# EAGLE design Dual Power (EAGLE 9.6.2)
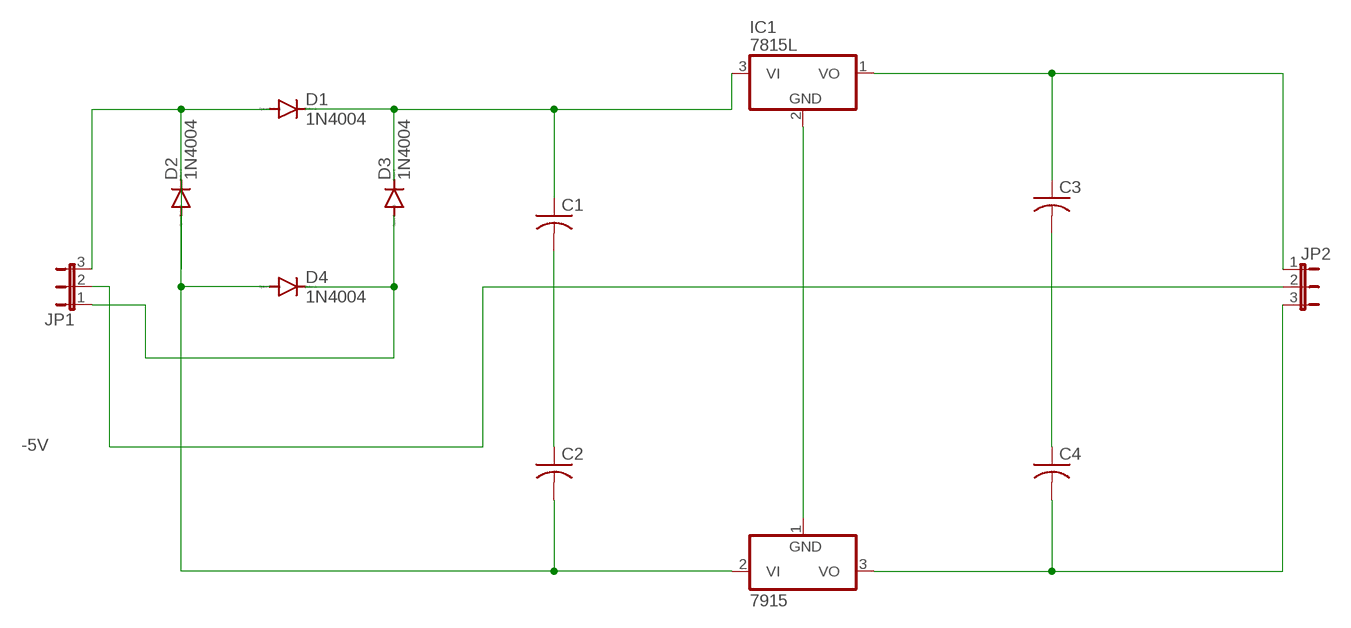
[diagram p0: schematic, sheet 1]

## Parts
7915  7915L  [TO92]
C1  C-US025-025X050  [C025-025X050]
C2  C-US025-025X050  [C025-025X050]
C3  C-US025-025X050  [C025-025X050]
C4  C-US025-025X050  [C025-025X050]
D1  1N4004  [DO41-10]
D2  1N4004  [DO41-10]
D3  1N4004  [DO41-10]
D4  1N4004  [DO41-10]
IC1  7815L  [TO92]
JP1  JP2E  [JP2]
JP2  -5V  JP2E  [JP2]

## Nets
N$1: D3.A D4.C JP1.1
N$2: D1.A D2.C JP1.3
N$3: C1.1 D1.C D3.C IC1.3(VI)
N$4: JP1.2 JP2.2
N$5: 7915.1(GND) IC1.2(GND)
N$6: C1.2 C2.1
N$7: C3.1 IC1.1(VO) JP2.1
N$8: 7915.3(VO) C4.2 JP2.3
N$9: C3.2 C4.1
N$12: 7915.2(VI) C2.2 D2.A D4.A

## Library data of the parts
7915 = linear:79*: Negative VOLTAGE REGULATOR
C1-C4 = rcl:C-US: CAPACITOR, American symbol; SPICEPREFIX: C
D1-D4 = diode:1N4004: DIODE general purpose rectifier, 1 A
IC1 = linear:78*: Positive VOLTAGE REGULATOR Source: http://cache.national.com/ds/LM/LM78L05.pdf http://www.fairchildsemi.com/ds/LM/LM7805.pdf
JP1 JP2 = jumper:JP2E: JUMPER

## Board
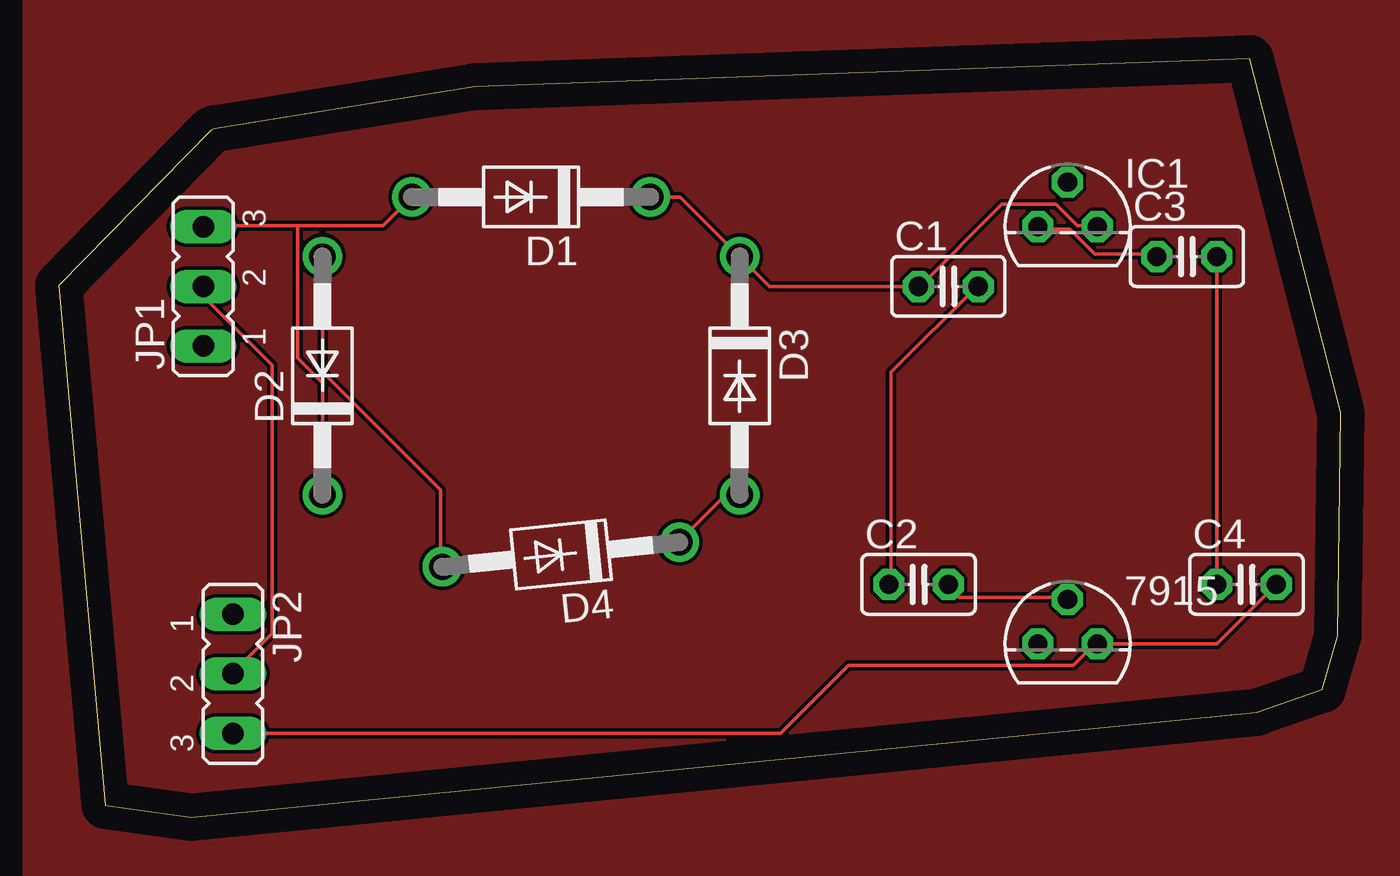
[diagram p1: board, top side]
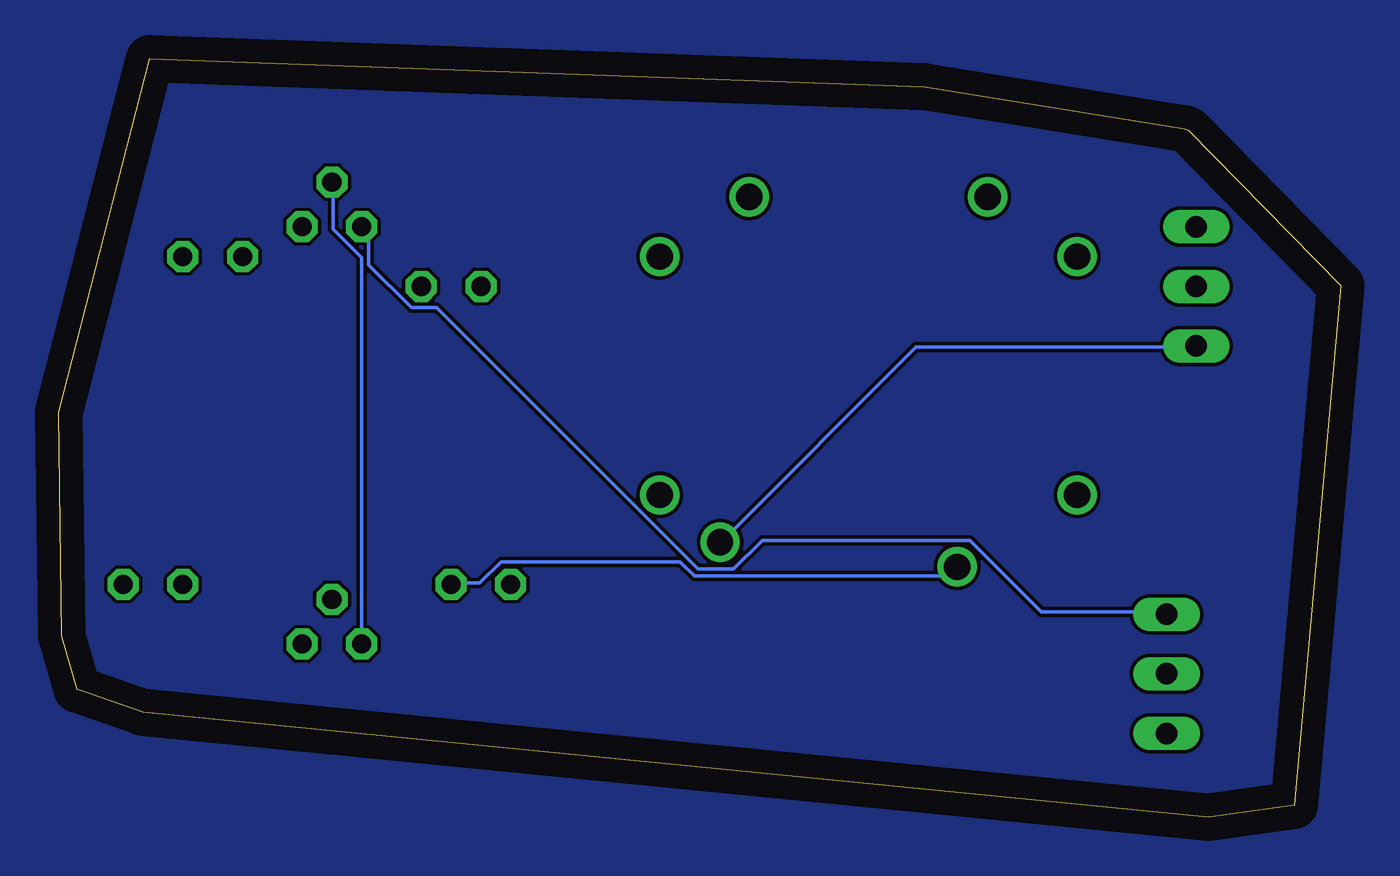
[diagram p2: board, bottom side, seen from below]

Size 54.63 x 32.33 mm. Coordinates in mm from the lower left corner, seen from the top.
Outline: 1.98,0.52 0,22.65 6.5,29.27 6.66,29.34 17.74,31.13 50.75,32.33
Outline: 1.98,0.52 1.98,0.52
Outline: 1.98,0.52 5.66,0 51.04,4.48 53.83,5.46
Outline: 53.83,5.46 53.83,5.46
Outline: 53.83,5.46 54.49,7.73 54.63,17.25 50.75,32.33
Outline: 50.75,32.33 50.75,32.33
Outline: 50.75,32.33 50.75,32.33
Copper layers (1*16): Top 0.035mm / dielectric 1.5mm / Bottom 0.035mm
Design rules "default": minimum track width 6mil, minimum drill 0.35mm, track to track 6mil, track to pad 6mil, pad to pad 6mil, via to via 6mil, smd to smd 6mil, copper to edge 40mil, drill to drill 6mil, minimum pad ring 10mil, minimum via ring 8mil, stop-mask expansion 4mil, vias tented up to drill 0mil, thermal gap 10mil

### Footprints (pad centres in the part's own frame; a part is rotated, then mirrored left to right if it is on the bottom)
TO92 = drill 0.813 octagon: 1 -1.27,0; 2 0,1.905; 3 1.27,0
C025-025X050 = drill 0.813 octagon: 1 -1.27,0; 2 1.27,0
DO41-10 = drill 1.118: A 5.08,0; C -5.08,0
JP2 = drill 0.914 long: 1 -2.54,0; 2 0,0; 3 2.54,0

### Placement (x,y rotation side)
7915  42.99,7.39 0 top
C1  37.91,22.63 0 top
C2  36.64,9.93 0 top
C3  48.07,23.9 0 top
C4  50.61,9.93 0 top
D1  20.13,26.44 180 top
D2  11.24,18.82 90 top
D3  29.02,18.82 270 top
D4  21.4,11.2 185.9 top
IC1  42.99,25.17 0 top
JP1  6.16,22.63 90 top
JP2  7.43,6.12 270 top

### Tracks (layer width: path | path; a pad name or v marks a point on that pad's centre or on a via)
GND
  pour Top: -1.46,35.33 60.77,35.33 60.77,-0.23 60.77,-4.04 59.5,-4.04 -1.46,-4.04
  pour Bottom: -4,37.87 65.85,37.87 65.85,-9.12 -4,-9.12
N$1
  Top 0.152: D3.A 28.92,13.63 28.31,13.63 26.48,11.81 D4.C
  Bottom 0.152: JP1.1 6.21,20.04 18.1,20.04 26.33,11.81 D4.C
N$2
  Top 0.152: 10.17,25.22 13.83,25.22 D1.A | 10.17,25.22 6.21,25.22 JP1.3 | D2.C 11.24,18.51 10.17,19.58 10.17,25.22
N$3
  Top 0.152: IC1.3 44.16,25.22 43.39,25.22 42.48,26.13 40.19,26.13 36.69,22.63 C1.1 30.29,22.63 D3.C 26.48,26.44 D1.C
N$4
  Top 0.152: JP1.2 6.21,22.63 6.21,22.17 9.1,19.27 9.1,7.84 7.43,6.17 JP2.2
N$5
  Bottom 0.152: 7915.1 41.72,23.85 42.94,25.06 42.94,27.05 IC1.2
N$6
  Top 0.152: C2.1 35.47,9.98 35.47,18.97 39.13,22.63 C1.2
N$7
  Top 0.152: IC1.1 41.72,25.06 43.09,25.06 44.16,24 46.75,24 C3.1
  Bottom 0.152: JP2.1 7.43,8.76 12.76,8.76 15.81,11.81 24.65,11.81 25.87,10.59 27.39,10.59 38.52,21.71 39.58,21.71 41.41,23.54 41.41,24.76 41.72,25.06 IC1.1
N$8
  Top 0.152: C4.2 49.34,7.39 7915.3 44.16,7.39 43.24,6.47 33.64,6.47 30.75,3.58 JP2.3
N$9
  Top 0.152: C3.2 C4.1
N$12
  Top 0.152: 7915.2 42.94,9.37 38.37,9.37 37.91,9.82 C2.2 | D2.A 11.24,18.97 16.27,13.94 16.27,10.74 D4.A
  Bottom 0.152: C2.2 37.91,9.98 36.69,9.98 35.77,10.89 28.15,10.89 27.55,10.28 16.72,10.28 16.42,10.59 D4.A